# Altium project PCB_Slave_Traffic_Light.PrjPcb (part 1 of 4)
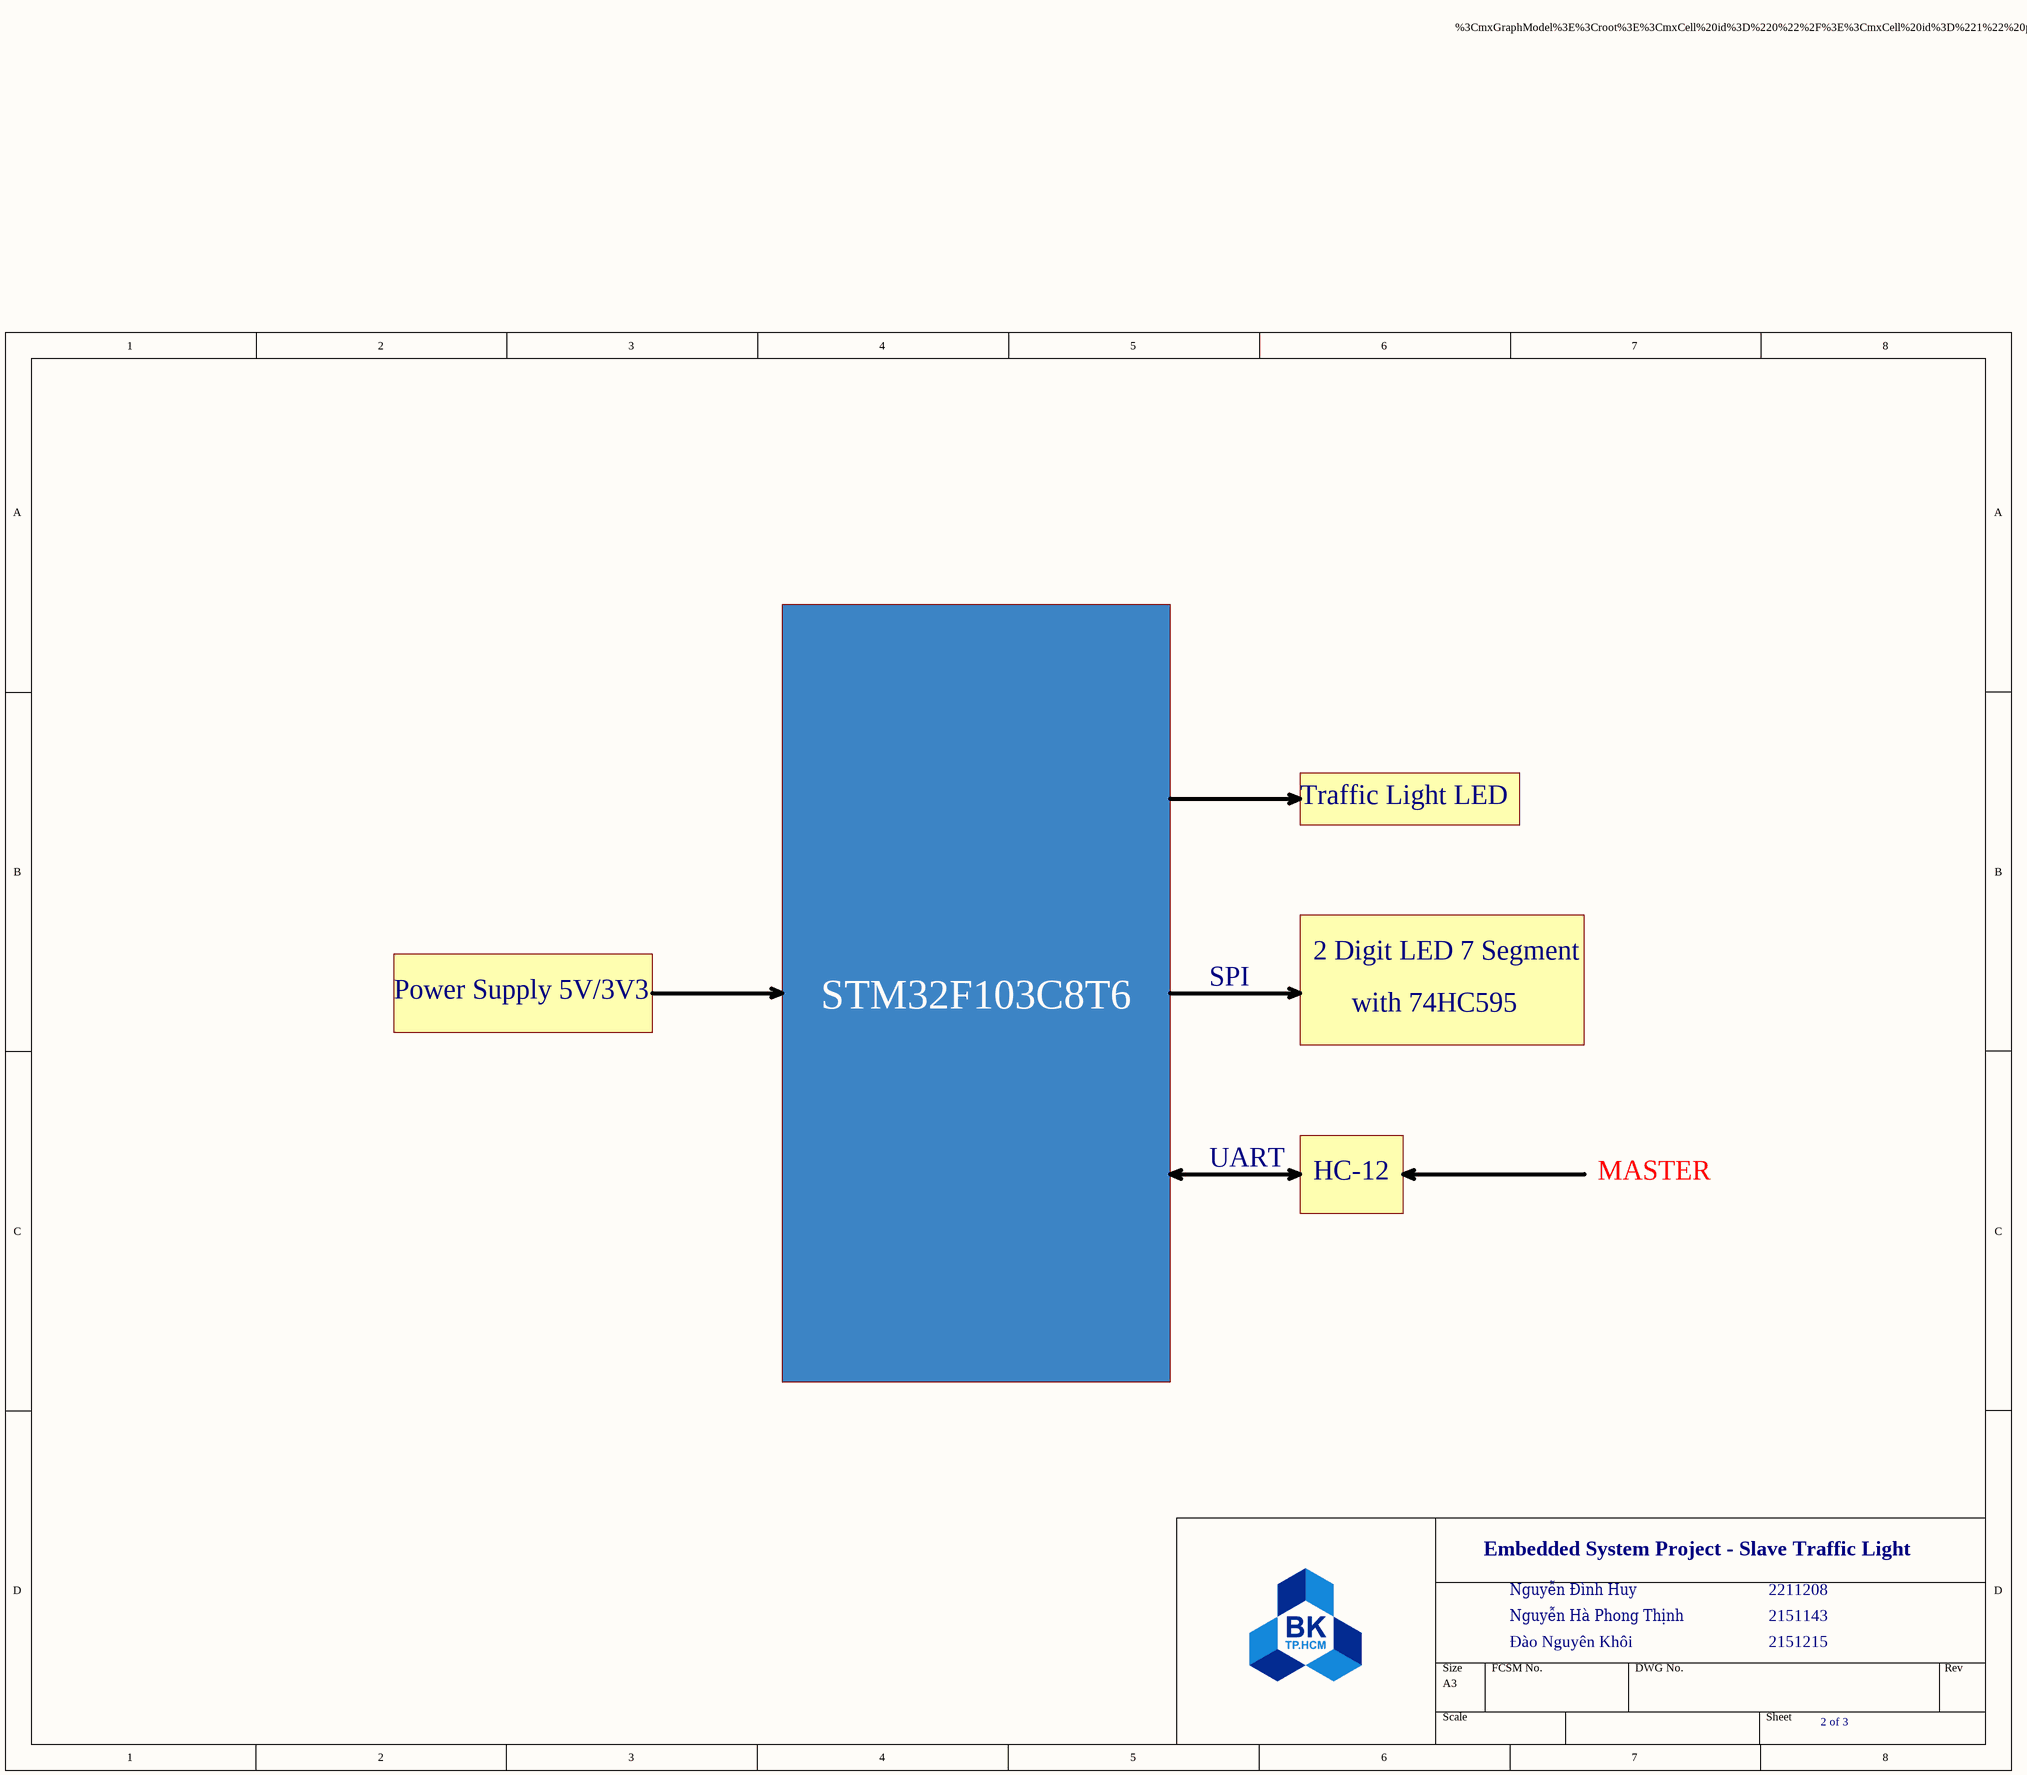
[diagram p0: PCB_Slave_Traffic_Light_BLOCK_DIAGRAM.SchDoc]
2 sheets, 5 parts. Net scope: global (net labels, ports and power ports of the same name join across sheets).
Board file: PCB_Slave_Traffic_Light.PcbDoc
Sheets:
  PCB_Slave_Traffic_Light_BLOCK_DIAGRAM.SchDoc
  PCB_Slave_Traffic_Light.SchDoc

## Sheet PCB_Slave_Traffic_Light_BLOCK_DIAGRAM.SchDoc
size A3; SheetNumber: 2; SheetTotal: 3
### Notes on the sheet